# EAGLE design board (EAGLE 6.1)
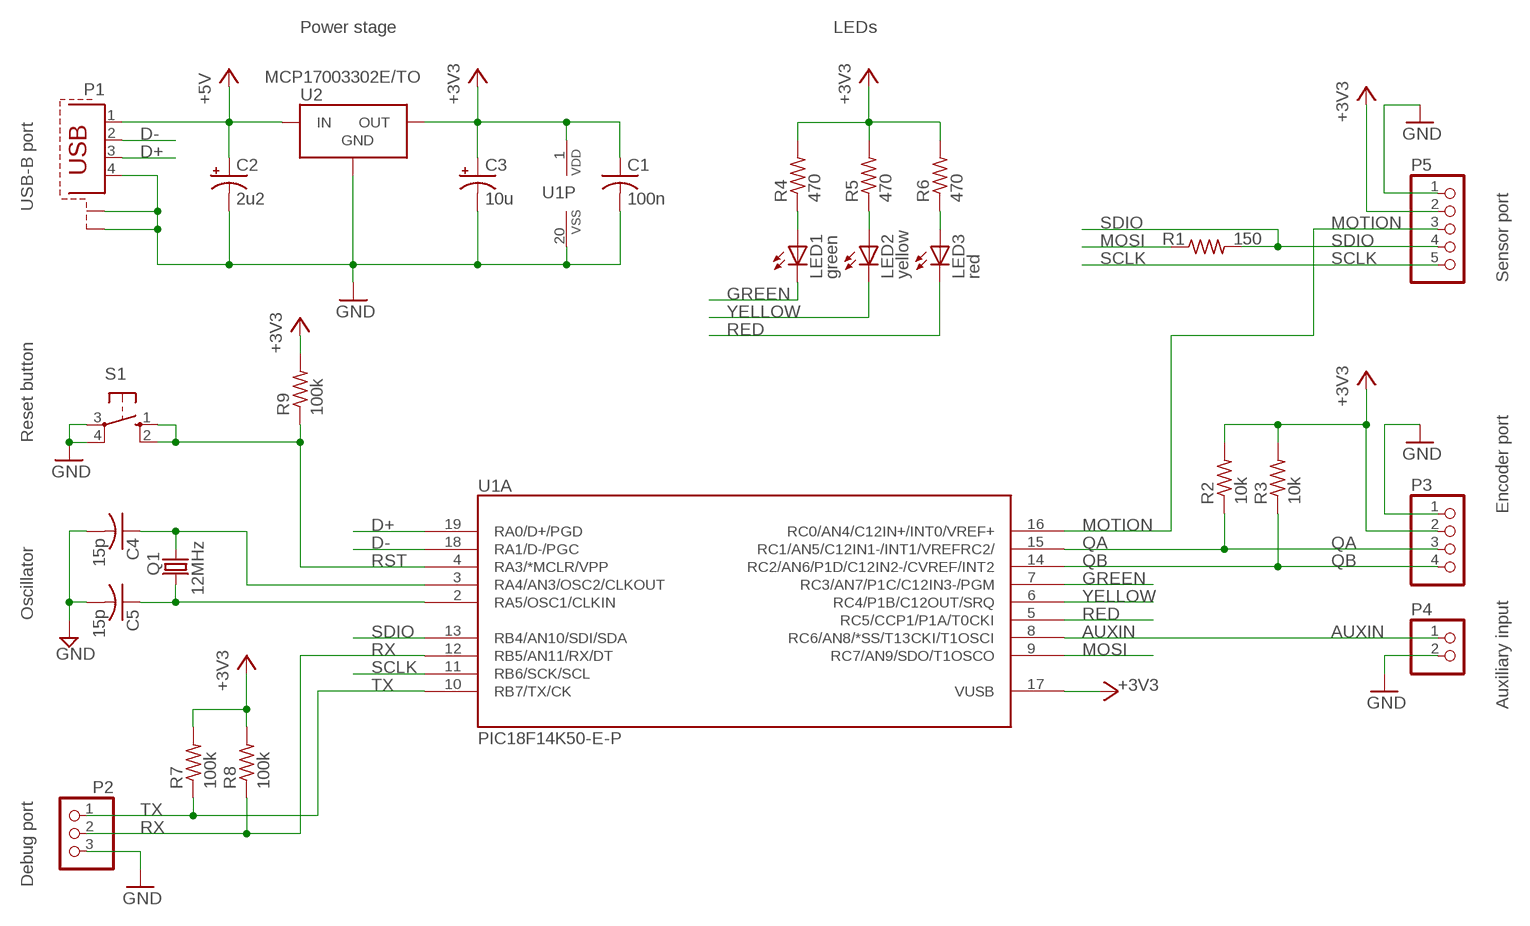
[diagram p0: schematic, sheet 1]

## Parts
C1  100n  C-US025-025X050  [C025-025X050]
C2  2u2  CPOL-USE2-5  [E2-5]
C3  10u  CPOL-USE2-5  [E2-5]
C4  15p  C-US025-025X050  [C025-025X050]
C5  15p  C-US025-025X050  [C025-025X050]
LED1  green  LED3MM  [LED3MM]
LED2  yellow  LED3MM  [LED3MM]
LED3  red  LED3MM  [LED3MM]
P1  PN61729-S  [PN61729-S]
P2  PINHD-1X3  [1X03]
P3  PINHD-1X4  [1X04]
P4  PINHD-1X2  [1X02]
P5  PINHD-1X5  [1X05]
Q1  12MHz  CRYSTALHC49S  [HC49/S]
R1  150  R-US_0207/10  [0207/10]
R2  10k  R-US_0204/5  [0204/5]
R3  10k  R-US_0204/5  [0204/5]
R4  470  R-US_0204/5  [0204/5]
R5  470  R-US_0204/5  [0204/5]
R6  470  R-US_0204/5  [0204/5]
R7  100k  R-US_0204/5  [0204/5]
R8  100k  R-US_0204/5  [0204/5]
R9  100k  R-US_0204/5  [0204/5]
S1  10-XX  [B3F-10XX]
U1  PIC18F14K50-E-P  [DIL20]
U2  MCP17003302E/TO  [TO-92]

## Nets
+3V3: C1.1 C3.+ P3.2 P5.2 R2.2 R3.2 R4.2 R5.2 R6.2 R7.2 R8.2 R9.2 U1.1(P:VDD) U1.17(A:VUSB) U2.OUT
+5V: C2.+ P1.1 U2.IN
AUXIN: P4.1 U1.8(A:RC6/AN8/*SS/T13CKI/T1OSCI)
D+: P1.3 U1.19(A:RA0/D+/PGD)
D-: P1.2 U1.18(A:RA1/D-/PGC)
GND: C1.2 C2.- C3.- C4.2 C5.2 P1.4 P1.S1 P1.S2 P2.3 P3.1 P4.2 P5.1 S1.3(P) S1.4(P1) U1.20(P:VSS) U2.GND
GREEN: LED1.K(C) U1.7(A:RC3/AN7/P1C/C12IN3-/PGM)
MOSI: R1.1 U1.9(A:RC7/AN9/SDO/T1OSCO)
MOTION: P5.3 U1.16(A:RC0/AN4/C12IN+/INT0/VREF+)
N$1: LED3.A R6.1
N$2: C4.1 Q1.1 U1.3(A:RA4/AN3/OSC2/CLKOUT)
N$3: C5.1 Q1.2 U1.2(A:RA5/OSC1/CLKIN)
N$4: LED2.A R5.1
N$5: LED1.A R4.1
QA: P3.3 R2.1 U1.15(A:RC1/AN5/C12IN1-/INT1/VREFRC2/)
QB: P3.4 R3.1 U1.14(A:RC2/AN6/P1D/C12IN2-/CVREF/INT2)
RED: LED3.K(C) U1.5(A:RC5/CCP1/P1A/T0CKI)
RST: R9.1 S1.1(S) S1.2(S1) U1.4(A:RA3/*MCLR/VPP)
RX: P2.2 R8.1 U1.12(A:RB5/AN11/RX/DT)
SCLK: P5.5 U1.11(A:RB6/SCK/SCL)
SDIO: P5.4 R1.2 U1.13(A:RB4/AN10/SDI/SDA)
TX: P2.1 R7.1 U1.10(A:RB7/TX/CK)
YELLOW: LED2.K(C) U1.6(A:RC4/P1B/C12OUT/SRQ)

## Notes on the sheet
- Power stage | LEDs
- USB-B port
- Sensor port
- Reset button
- Encoder port
- Oscillator
- Auxiliary input
- Debug port

## Library data of the parts
C1 C4 C5 = rcl:C-US: CAPACITOR, American symbol
C2 C3 = rcl:CPOL-US: POLARIZED CAPACITOR, American symbol
LED1-LED3 = led:LED: LED OSRAM: - CHIPLED LG R971, LG N971, LY N971, LG Q971, LY Q971, LO R971, LY R971 LH N974, LH R974 LS Q976, LO Q976, LY Q976 LO Q996 - Hyper CHIPLED LW Q18S LB Q993, LB Q99A, LB R99A - SideLED LS A670, LO A670, LY A670, LG A670, LP A670 LB A673, LV A673, LT A673, LW A673 LH A674 LY A675 LS A676, LA A676, LO A676, LY A676, LW A676 LS A679, LY A679, LG A679 - Hyper Micro SIDELED® LS Y876, LA Y876, LO Y876, LY Y876 LT Y87S - SmartLED LW L88C, LW L88S LB L89C, LB L89S, LG L890 LS L89K, LO L89K, LY L89K LS L896, LA L896, LO L896, LY L896 - TOPLED LS T670, LO T670, LY T670, LG T670, LP T670 LSG T670, LSP T670, LSY T670, LOP T670, LYG T670 LG T671, LOG T671, LSG T671 LB T673, LV T673, LT T673, LW T673 LH T674 LS T676, LA T676, LO T676, LY T676, LB T676, LH T676, LSB T676, LW T676 LB T67C, LV T67C, LT T67C, LS T67K, LO T67K, LY T67K, LW E67C LS E67B, LA E67B, LO E67B, LY E67B, LB E67C, LV E67C, LT E67C LW T67C LS T679, LY T679, LG T679 LS T770, LO T770, LY T770, LG T770, LP T770 LB T773, LV T773, LT T773, LW T773 LH T774 LS E675, LA E675, LY E675, LS T675 LS T776, LA T776, LO T776, LY T776, LB T776 LHGB T686 LT T68C, LB T68C - Hyper Mini TOPLED® LB M676 - Mini TOPLED Santana® LG M470 LS M47K, LO M47K, LY M47K Source: http://www.osram.convergy.de LUXEON: - LUMILED® LXK2-PW12-R00, LXK2-PW12-S00, LXK2-PW14-U00, LXK2-PW14-V00 LXK2-PM12-R00, LXK2-PM12-S00, LXK2-PM14-U00 LXK2-PE12-Q00, LXK2-PE12-R00, LXK2-PE12-S00, LXK2-PE14-T00, LXK2-PE14-U00 LXK2-PB12-K00, LXK2-PB12-L00, LXK2-PB12-M00, LXK2-PB14-N00, LXK2-PB14-P00, LXK2-PB14-Q00 LXK2-PR12-L00, LXK2-PR12-M00, LXK2-PR14-Q00, LXK2-PR14-R00 LXK2-PD12-Q00, LXK2-PD12-R00, LXK2-PD12-S00 LXK2-PH12-R00, LXK2-PH12-S00 LXK2-PL12-P00, LXK2-PL12-Q00, LXK2-PL12-R00 Source: www.luxeon.com KINGBRIGHT: KA-3528ASYC Source: www.kingbright.com
P1 = con-berg:PN61729-S: BERG USB connector; OC_FARNELL: unknown; OC_NEWARK: unknown
P2 = pinhead:PINHD-1X3: PIN HEADER
P3 = pinhead:PINHD-1X4: PIN HEADER
P4 = pinhead:PINHD-1X2: PIN HEADER
P5 = pinhead:PINHD-1X5: PIN HEADER
Q1 = crystal:CRYSTAL: CRYSTAL; OC_FARNELL: 1667008; OC_NEWARK: unknown
R1-R9 = rcl:R-US_: RESISTOR, American symbol
S1 = switch-omron:10-XX: OMRON SWITCH; MPN: B3F-1000; OC_FARNELL: 176432; OC_NEWARK: 36M3542
U1 = microchip_local:PIC18F14K50-E-P
U2 = microchip_local:MCP1700

## Board
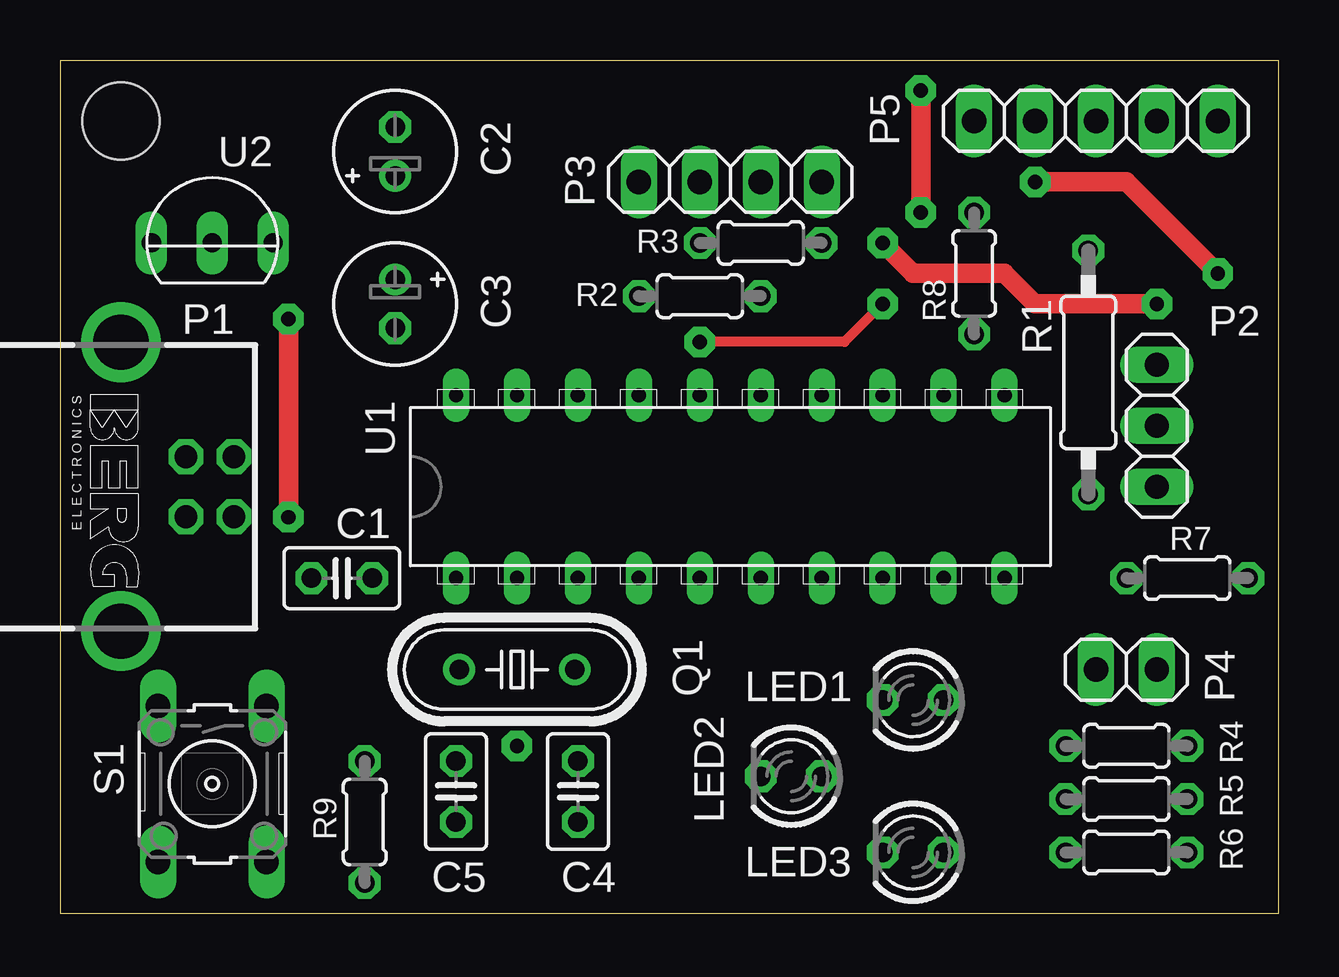
[diagram p1: board, top side]
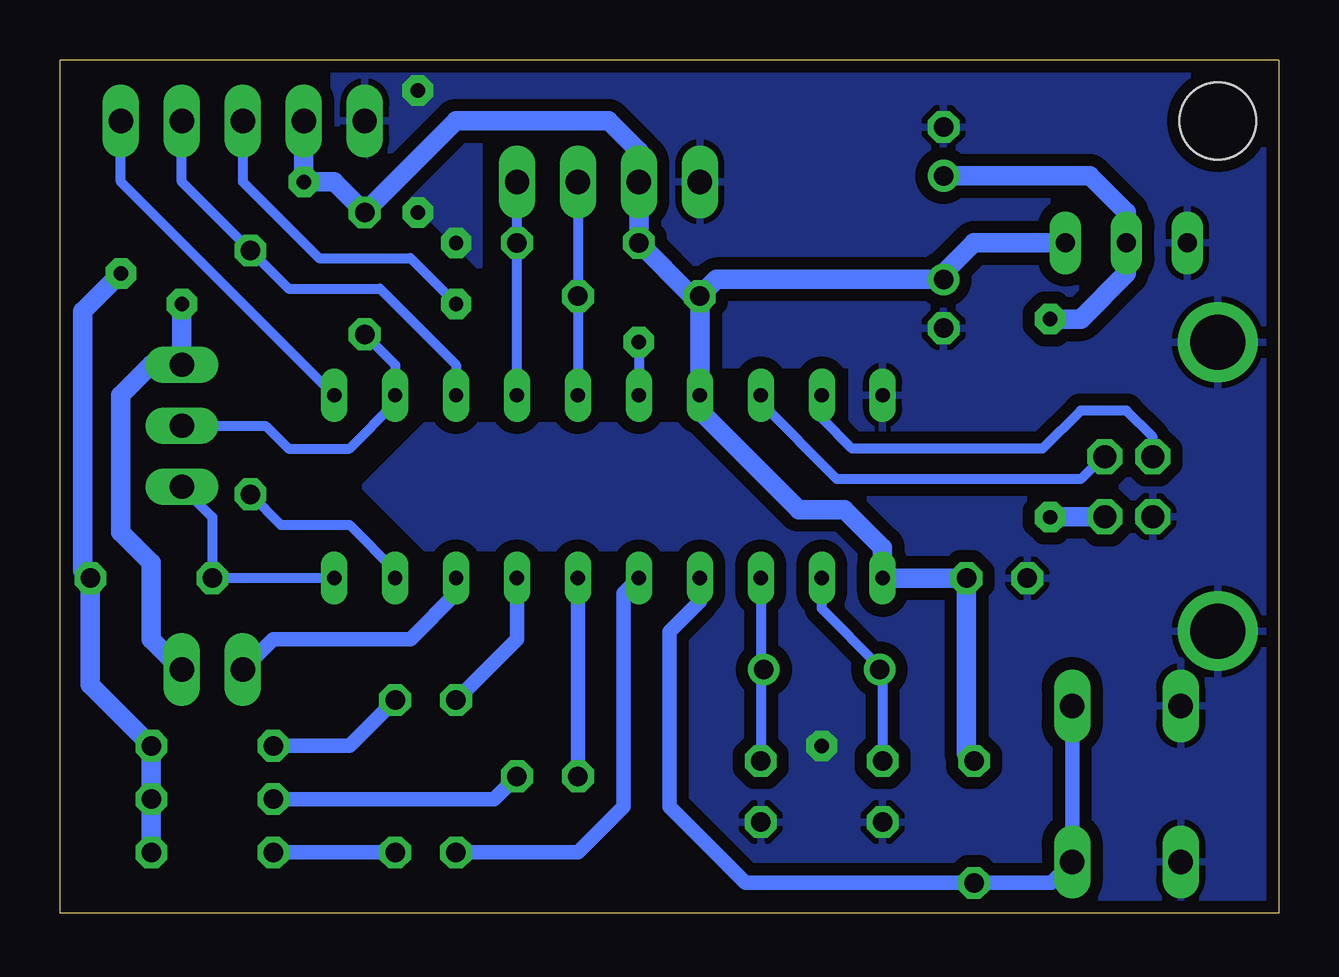
[diagram p2: board, bottom side, seen from below]

Size 50.8 x 35.56 mm. Coordinates in mm from the lower left corner, seen from the top.
Outline: 0,0 50.8,0 50.8,35.56 0,35.56 0,0
Copper layers (1*16): Top 0.035mm / dielectric 1.5mm / Bottom 0.035mm
Design rules: minimum track width 10mil, minimum drill 10mil, track to track 20mil, track to pad 20mil, pad to pad 20mil, via to via 20mil, smd to smd 20mil, copper to edge 20mil, drill to drill 8mil, minimum pad ring 10mil, minimum via ring 8mil, stop-mask expansion 4mil, vias tented up to drill 0mil, thermal gap 10mil
Holes 3.2 mm at 2.54,33.02

### Footprints (pad centres in the part's own frame; a part is rotated, then mirrored left to right if it is on the bottom)
C025-025X050 = drill 0.813 octagon: 1 -1.27,0; 2 1.27,0
E2-5 = drill 0.813 pad 1.27: + -1.016,0 | drill 0.813 pad 1.27 octagon: - 1.016,0
LED3MM = drill 0.813 octagon: A -1.27,0; K 1.27,0
PN61729-S = drill 0.95 octagon: 1 1.25,4.71; 2 -1.25,4.71; 3 -1.25,2.71; 4 1.25,2.71 | drill 2.3 pad 2.9: S1 -6.02,0; S2 6.02,0
1X03 = drill 1.016 long: 1 -2.54,0; 2 0,0; 3 2.54,0
1X04 = drill 1.016 long: 1 -3.81,0; 2 -1.27,0; 3 1.27,0; 4 3.81,0
1X02 = drill 1.016 long: 1 -1.27,0; 2 1.27,0
1X05 = drill 1.016 long: 1 -5.08,0; 2 -2.54,0; 3 0,0; 4 2.54,0; 5 5.08,0
HC49/S = drill 0.813: 1 -2.413,0; 2 2.413,0
0207/10 = drill 0.813 octagon: 1 -5.08,0; 2 5.08,0
0204/5 = drill 0.813 octagon: 1 -2.54,0; 2 2.54,0
B3F-10XX = drill 1.016 long: 1 -3.251,2.261; 2 3.251,2.261; 3 -3.251,-2.261; 4 3.251,-2.261
DIL20 = drill 0.6 pad 1.016 long: 1 -3.81,11.43; 2 -3.81,8.89; 3 -3.81,6.35; 4 -3.81,3.81; 5 -3.81,1.27; 6 -3.81,-1.27; 7 -3.81,-3.81; 8 -3.81,-6.35; 9 -3.81,-8.89; 10 -3.81,-11.43; 11 3.81,-11.43; 12 3.81,-8.89; 13 3.81,-6.35; 14 3.81,-3.81; 15 3.81,-1.27; 16 3.81,1.27; 17 3.81,3.81; 18 3.81,6.35; 19 3.81,8.89; 20 3.81,11.43
TO-92 = drill 0.8 long: GND -2.54,0; IN 0,0; OUT 2.54,0

### Placement (x,y rotation side)
C1  11.75,13.97 180 top
C2  13.97,31.75 90 top
C3  13.97,25.4 270 top
C4  21.59,5.08 270 top
C5  16.51,5.08 270 top
LED1  35.56,8.89 180 top
LED2  30.48,5.71 180 top
LED3  35.56,2.54 180 top
P1  2.54,17.78 270 top
P2  45.72,20.32 90 top
P3  27.94,30.48 0 top
P4  44.45,10.16 0 top
P5  43.18,33.02 0 top
Q1  19.05,10.16 180 top
R1  42.86,22.54 90 top
R2  26.67,25.72 180 top
R3  29.21,27.94 180 top
R4  44.45,6.99 0 top
R5  44.45,4.76 0 top
R6  44.45,2.54 0 top
R7  46.99,13.97 0 top
R8  38.1,26.67 90 top
R9  12.7,3.81 90 top
S1  6.35,5.4 270 top
U1  27.94,17.78 90 top
U2  6.35,27.94 0 top

### Tracks (layer width: path | path; a pad name or v marks a point on that pad's centre or on a via)
+3V3  (via drill 0.6 pad 1.27)
  Top 0.813: v48.26,26.67 44.45,30.48 v40.64,30.48
  Bottom 0.813: v48.26,26.67 49.85,25.08 49.85,14.29 R7.2 49.53,9.53 R4.2 R5.2 R6.2 | P5.2 v40.64,30.48 39.37,30.48 R8.2 34.29,33.02 27.94,33.02 26.67,31.75 P3.2 R3.2 24.45,25.72 R2.2 | R9.2 13.02,6.67 C1.1 U1.1 16.51,15.24 18.1,16.83 20,16.83 24.13,20.95 U1.17 R2.2 | U2.OUT 12.7,27.94 13.97,26.67 C3.+ 23.43,26.42 R2.2
+5V  (via drill 0.6 pad 1.27)
  Top 0.813: v9.53,16.51 v9.53,24.77
  Bottom 0.813: P1.1 9.53,16.53 v9.53,16.51 | C2.+ 7.87,30.73 6.35,29.21 U2.IN 6.35,26.67 8.26,24.77 v9.53,24.77
AUXIN
  Bottom 0.61: P4.1 41.91,11.43 36.2,11.43 34.29,13.34 U1.8
D+
  Bottom 0.406: P1.3 5.25,19.86 6.35,20.95 8.26,20.95 9.84,19.37 17.78,19.37 19.05,20.64 U1.19
D-
  Bottom 0.406: P1.2 7.32,19.03 8.26,18.1 18.41,18.1 21.59,21.27 U1.18
GND  (via drill 0.6 pad 1.27)
  Top 0.813: v45.72,25.4 40.64,25.4 39.37,26.67 35.56,26.67 v34.29,27.94 | v35.88,34.29 v35.88,29.21
  Bottom 0.813: P4.2 46.99,11.43 46.99,14.61 48.26,15.88 48.26,21.59 46.99,22.86 P2.3 v45.72,25.4
  other vias: 19.05,6.99
  pour Bottom: 25.4,0 0,0 0,35.56 39.37,35.56 39.37,33.02 33.34,26.99 33.34,33.02 31.75,33.02 24.13,25.72 24.13,22.86 17.78,22.86 17.78,20.32 35.56,20.32 38.1,17.78 35.56,15.24 24.13,15.24 24.13,12.7 25.4,11.43
GREEN
  Bottom 0.61: LED1.K 31.75,11.43 U1.7
MOSI
  Bottom 0.406: R1.1 41.59,16.19 38.73,16.19 36.83,14.29 U1.9
MOTION  (via drill 0.6 pad 1.27)
  Top 0.406: v34.29,25.4 32.7,23.81 v26.67,23.81
  Bottom 0.406: P5.3 43.18,30.48 40.01,27.3 36.2,27.3 v34.29,25.4 | v26.67,23.81 U1.16
N$1
  Bottom 0.61: LED3.A R6.1
N$2
  Bottom 0.406: C4.1 21.59,10.16 Q1.1 21.59,10.29 U1.3
N$3
  Bottom 0.406: C5.1 16.51,10.16 Q1.2 16.64,10.29 19.05,12.7 U1.2
N$4
  Bottom 0.61: R5.1 32.7,4.76 LED2.A
N$5
  Bottom 0.61: LED1.A 38.73,6.99 R4.1
QA
  Bottom 0.406: P3.3 R2.1 U1.15
QB
  Bottom 0.406: U1.14 R3.1 P3.4
RED
  Bottom 0.61: LED3.K 29.21,2.54 27.3,4.45 27.3,13.34 U1.5
RST
  Bottom 0.61: U1.4 24.13,13.02 25.4,11.75 25.4,4.45 22.23,1.27 R9.1 9.49,1.27 S1.2 S1.1
RX
  Bottom 0.406: P2.2 42.23,20.32 41.27,19.37 38.73,19.37 36.83,21.27 U1.12 36.83,22.86 R8.1
SCLK
  Bottom 0.406: P5.5 48.26,30.48 U1.11
SDIO
  Bottom 0.406: P5.4 45.72,30.48 R1.2 41.27,26.04 37.47,26.04 34.29,22.86 U1.13
TX
  Bottom 0.406: P2.1 44.45,16.51 R7.1 U1.10
YELLOW
  Bottom 0.61: U1.6 LED2.K

### Text on the board
Document: GND | 3V3 | QA | QB | 1 | 5 | GND | RX | TX | IN | GND